# EAGLE design SmodIOXP (EAGLE 6.3)
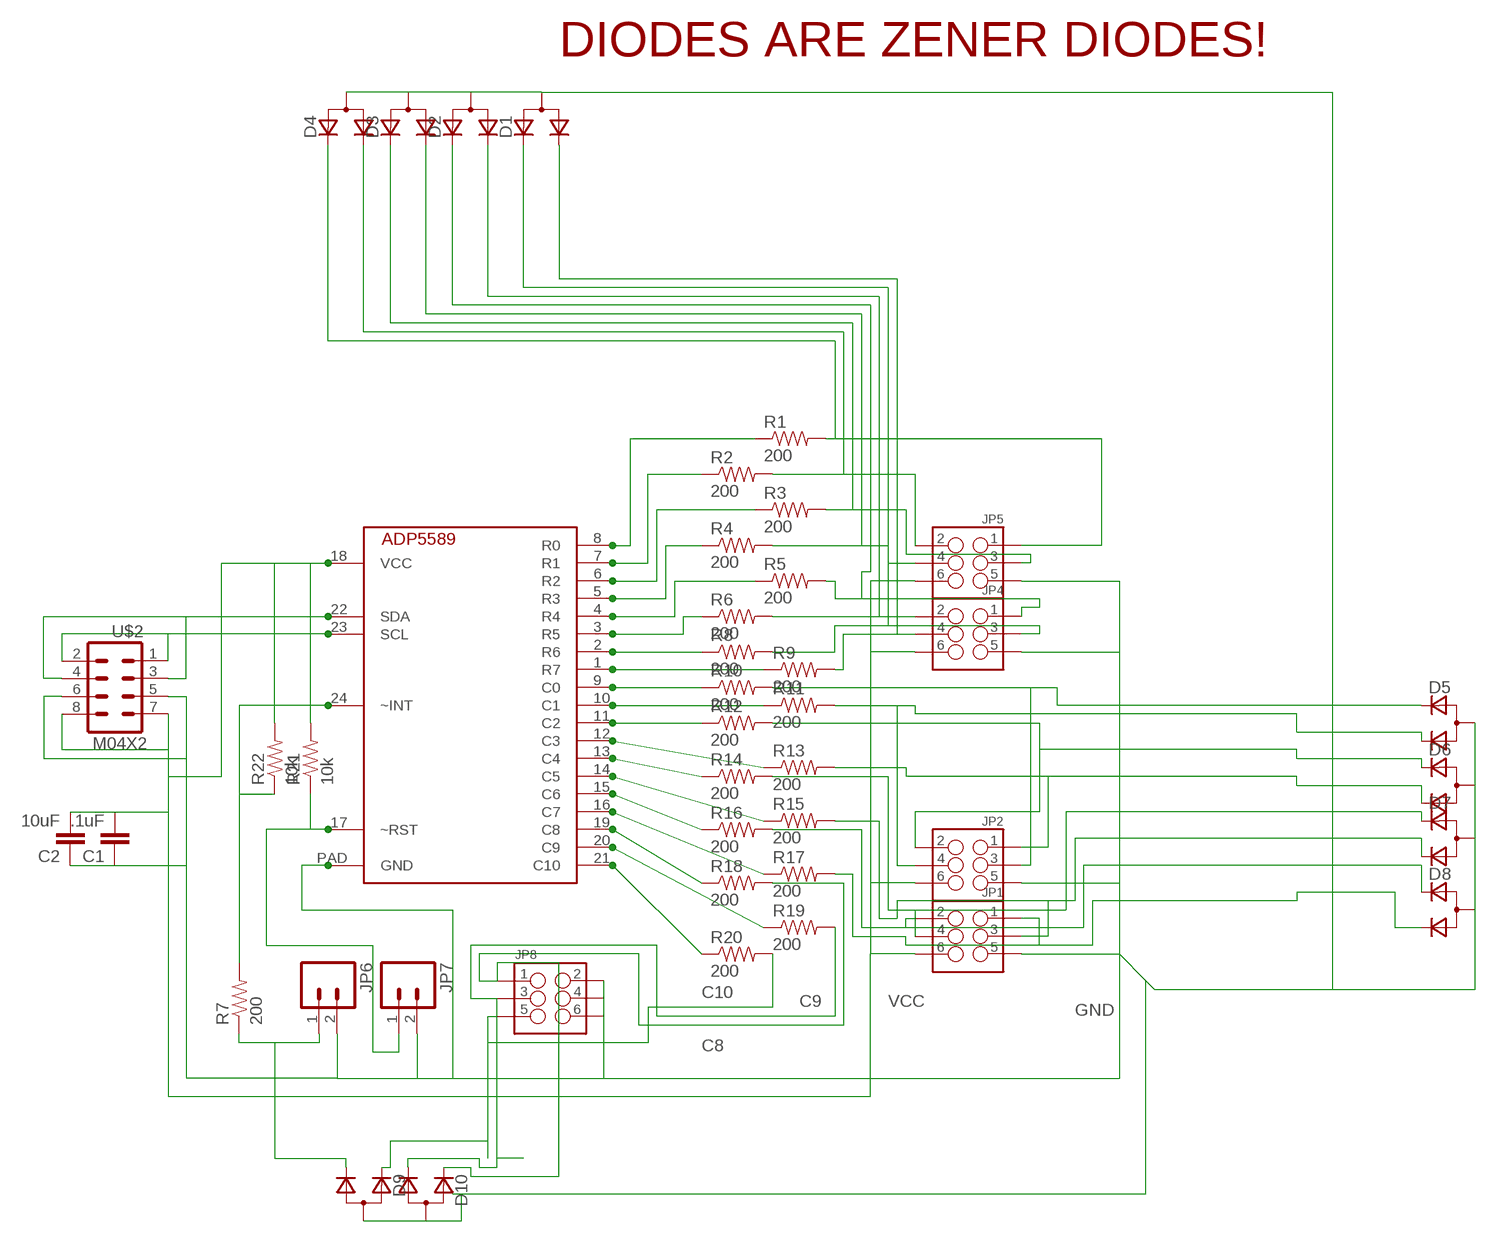
[diagram p0: schematic, sheet 1]

## Parts
C1  .1uF  CAP0603-CAP  [0603-CAP]
C2  10uF  CAP0603-CAP  [0603-CAP]
D1  D_2CSOT23  [SOT-23]
D2  D_2CSOT23  [SOT-23]
D3  D_2CSOT23  [SOT-23]
D4  D_2CSOT23  [SOT-23]
D5  D_2CSOT23  [SOT-23]
D6  D_2CSOT23  [SOT-23]
D7  D_2CSOT23  [SOT-23]
D8  D_2CSOT23  [SOT-23]
D9  D_2CSOT23  [SOT-23]
D10  D_2CSOT23  [SOT-23]
JP1  M03X2POGO_PINS  [2X3_POGO]
JP2  M03X2POGO_PINS  [2X3_POGO]
JP4  M03X2POGO_PINS  [2X3_POGO]
JP5  M03X2POGO_PINS  [2X3_POGO]
JP6  M02PTH  [1X02]
JP7  M02PTH  [1X02]
JP8  M03X2POGO_PINS  [2X3_POGO]
R1  200  RESISTOR0603-RES  [0603-RES]
R2  200  RESISTOR0603-RES  [0603-RES]
R3  200  RESISTOR0603-RES  [0603-RES]
R4  200  RESISTOR0603-RES  [0603-RES]
R5  200  RESISTOR0603-RES  [0603-RES]
R6  200  RESISTOR0603-RES  [0603-RES]
R7  200  RESISTOR0603-RES  [0603-RES]
R8  200  RESISTOR0603-RES  [0603-RES]
R9  200  RESISTOR0603-RES  [0603-RES]
R10  200  RESISTOR0603-RES  [0603-RES]
R11  200  RESISTOR0603-RES  [0603-RES]
R12  200  RESISTOR0603-RES  [0603-RES]
R13  200  RESISTOR0603-RES  [0603-RES]
R14  200  RESISTOR0603-RES  [0603-RES]
R15  200  RESISTOR0603-RES  [0603-RES]
R16  200  RESISTOR0603-RES  [0603-RES]
R17  200  RESISTOR0603-RES  [0603-RES]
R18  200  RESISTOR0603-RES  [0603-RES]
R19  200  RESISTOR0603-RES  [0603-RES]
R20  200  RESISTOR0603-RES  [0603-RES]
R21  10k  RESISTOR0603-RES  [0603-RES]
R22  10k  RESISTOR0603-RES  [0603-RES]
U$1  ADP5589LFCSP(QFN)  [24-LFCSP]
U$2  M04X2  [2X4]

## Nets
C0: D5.2(C1) JP2.P$3 R10.2
C1: D5.3(C2) JP2.P$4 R11.2
C2: D6.2(C1) JP2.P$2 R12.2
C3: D6.3(C2) JP2.P$1 R13.2
C4: D7.2(C1) JP1.P$4 R14.2
C5: D7.3(C2) JP1.P$3 R15.2
C6: D8.2(C1) JP1.P$2 R16.2
C7: D8.3(C2) JP1.P$1 R17.2
C8: D10.2(C1) JP8.P$1 R18.2
C9: D10.3(C2) JP8.P$3 R19.2
C10: D9.2(C1) JP8.P$5 R20.2
GND: C1.1 C2.1 D1.1(A) D2.1(A) D3.1(A) D4.1(A) D5.1(A) D6.1(A) D7.1(A) D8.1(A) D9.1(A) D10.1(A) JP1.P$5 JP2.P$5 JP4.P$5 JP5.P$5 JP6.2 JP7.2 JP8.P$2 JP8.P$4 JP8.P$6 U$1.PAD(GND) U$2.5 U$2.6
N$1: R1.1 U$1.8(R0)
N$3: R2.1 U$1.7(R1)
N$5: R3.1 U$1.6(R2)
N$6: D9.3(C2) JP6.1 R7.1
N$7: R4.1 U$1.5(R3)
N$9: R5.1 U$1.4(R4)
N$11: R6.1 U$1.3(R5)
N$13: R8.1 U$1.2(R6)
N$15: R9.1 U$1.1(R7)
N$17: R10.1 U$1.9(C0)
N$19: R11.1 U$1.10(C1)
N$21: R12.1 U$1.11(C2)
N$23: R13.1 U$1.12(C3)
N$25: R14.1 U$1.13(C4)
N$27: R15.1 U$1.14(C5)
N$29: R16.1 U$1.15(C6)
N$31: R17.1 U$1.16(C7)
N$33: R18.1 U$1.19(C8)
N$35: R19.1 U$1.20(C9)
N$37: R20.1 U$1.21(C10)
R0: D4.2(C1) JP5.P$1 R1.2
R1: D4.3(C2) JP5.P$2 R2.2
R2: D3.2(C1) JP5.P$3 R3.2
R3: D3.3(C2) JP5.P$4 R4.2
R4: D2.2(C1) JP4.P$1 R5.2
R5: D2.3(C2) JP4.P$2 R6.2
R6: D1.2(C1) JP4.P$3 R8.2
R7: D1.3(C2) JP4.P$4 R9.2
SCL: U$1.23(SCL) U$2.1 U$2.2
SDA: U$1.22(SDA) U$2.3 U$2.4
VCC: C1.2 C2.2 JP1.P$6 JP2.P$6 JP4.P$6 JP5.P$6 R21.2 R22.2 U$1.18(VCC) U$2.7 U$2.8
~INT: R7.2 R22.1 U$1.24(~INT)
~RST: JP7.1 R21.1 U$1.17(~RST)

## Notes on the sheet
- DIODES ARE ZENER DIODES!

## Library data of the parts
C1 C2 = SparkFun-Passives:CAP: Capacitor Standard 0603 ceramic capacitor, and 0.1" leaded capacitor.
D1-D10 = zetex:D_2C: Dual DIODE; OC_FARNELL: unknown; OC_NEWARK: unknown
JP1 JP2 JP4 JP5 JP8 = SparkFun-Connectors:M03X2: 2x3 .1" header. Shrouded, with keying- CONN-10681 SMT- CONN-11415 Pogo pins- HW-11044; PROD_ID: HW-11044
JP6 JP7 = SparkFun-Connectors:M02: Header 2 Standard 2-pin 0.1" header. Use with straight break away headers (SKU : PRT-00116), right angle break away headers (PRT-00553), swiss pins (PRT-00743), machine pins (PRT-00117), and female headers (PRT-00115). Molex polarized connector foot print use with SKU : PRT-08233 with associated crimp pins and housings.
R1-R22 = SparkFun-Passives:RESISTOR: Resistor Basic schematic elements and footprints for 0603, 1206, and PTH resistors.
U$1 = Strutz Electronic Industries:ADP5589
U$2 = SparkFun-Connectors:M04X2: .1" header, two rows of four.

## Board
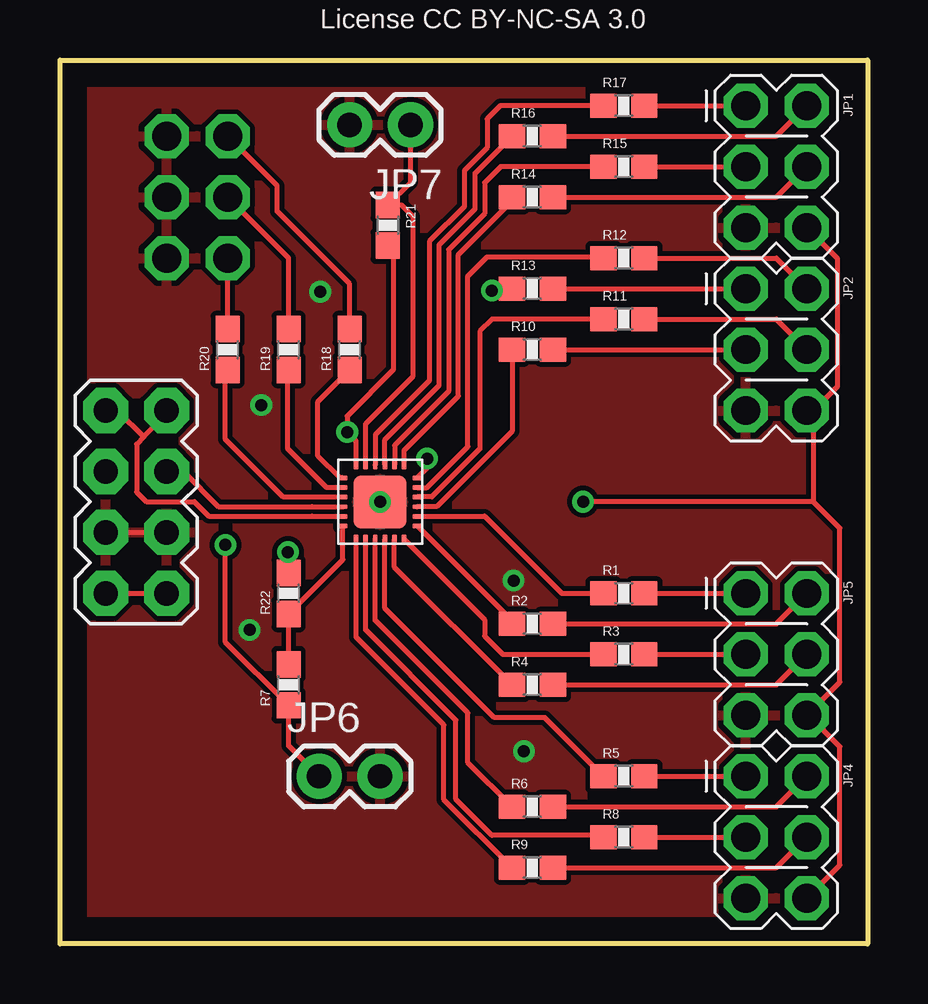
[diagram p1: board, top side]
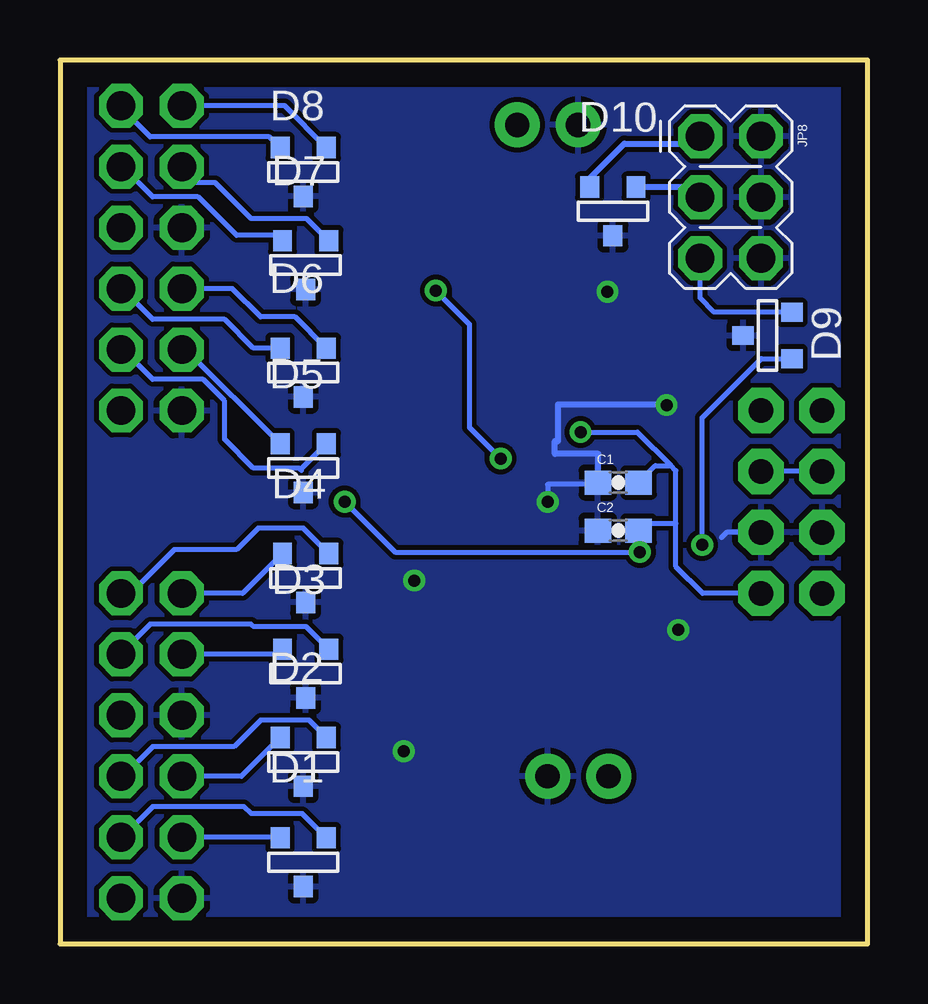
[diagram p2: board, bottom side, seen from below]

Size 33.66 x 36.83 mm. Coordinates in mm from the lower left corner, seen from the top.
Outline: 33.66,0 0,0 0,36.83 33.66,36.83 33.66,0
Copper layers (1*16): Top 0.035mm / dielectric 1.5mm / Bottom 0.035mm
Design rules "default": minimum track width 10mil, minimum drill 24mil, track to track 8mil, track to pad 8mil, pad to pad 8mil, via to via 8mil, smd to smd 8mil, copper to edge 40mil, drill to drill 8mil, minimum pad ring 10mil, minimum via ring 8mil, stop-mask expansion 4mil, vias tented up to drill 0mil, thermal gap 10mil

### Footprints (pad centres in the part's own frame; a part is rotated, then mirrored left to right if it is on the bottom)
0603-CAP = smd 1.1 x 1: 1 -0.85,0; 2 0.85,0
SOT-23 = smd 0.787 x 0.889: 1 0.025,-1.016; 2 -0.94,1.016; 3 0.991,1.016
2X3_POGO = drill 1.2 pad 1.829 octagon: P$1 0,0; P$2 0,2.54; P$3 2.54,0; P$4 2.54,2.54; P$5 5.08,0; P$6 5.08,2.54
1X02 = drill 1.016 pad 1.88: 1 0,0; 2 2.54,0
0603-RES = smd 1.1 x 1: 1 -0.85,0; 2 0.85,0
24-LFCSP = smd 0.4 x 0.2: 1 -1.55,1; 2 -1.55,0.6; 3 -1.55,0.2; 4 -1.55,-0.2; 5 -1.55,-0.6; 6 -1.55,-1; 13 1.55,-1; 14 1.55,-0.6; 15 1.55,-0.2; 16 1.55,0.2; 17 1.55,0.6; 18 1.55,1 | smd 0.2 x 0.4: 7 -1,-1.55; 8 -0.6,-1.55; 9 -0.2,-1.55; 10 0.2,-1.55; 11 0.6,-1.55; 12 1,-1.55; 19 1,1.55; 20 0.6,1.55; 21 0.2,1.55; 22 -0.2,1.55; 23 -0.6,1.55; 24 -1,1.55 | smd 2.2 x 2.2: PAD 0,0
2X4 = drill 1.016 pad 1.88 octagon: 1 -3.81,-1.27; 2 -3.81,1.27; 3 -1.27,-1.27; 4 -1.27,1.27; 5 1.27,-1.27; 6 1.27,1.27; 7 3.81,-1.27; 8 3.81,1.27

### Placement (x,y rotation side)
C1  10.4,19.22 0 bottom
C2  10.4,17.22 0 bottom
D1  23.54,3.41 0 bottom
D2  23.54,7.58 0 bottom
D3  23.45,11.27 0 bottom
D4  23.45,15.25 0 bottom
D5  23.54,19.82 0 bottom
D6  23.54,23.8 0 bottom
D7  23.45,28.29 0 bottom
D8  23.54,32.17 0 bottom
D9  4.17,25.38 270 bottom
D10  10.65,30.53 0 bottom
JP1  28.57,34.93 270 top
JP2  28.57,27.3 270 top
JP4  28.57,6.99 270 top
JP5  28.57,14.61 270 top
JP6  10.79,6.99 0 top
JP7  14.61,34.12 180 top
JP8  6.99,33.66 270 bottom
R1  23.49,14.61 0 top
R2  19.68,13.34 0 top
R3  23.49,12.07 0 top
R4  19.68,10.8 0 top
R5  23.49,6.99 0 top
R6  19.68,5.72 0 top
R7  9.53,10.8 90 top
R8  23.49,4.45 0 top
R9  19.68,3.17 0 top
R10  19.68,24.77 0 top
R11  23.49,26.04 0 top
R12  23.49,28.57 0 top
R13  19.68,27.3 0 top
R14  19.68,31.11 0 top
R15  23.49,32.39 0 top
R16  19.68,33.66 0 top
R17  23.49,34.93 0 top
R18  12.07,24.77 90 top
R19  9.53,24.77 90 top
R20  6.99,24.77 90 top
R21  13.66,29.94 270 top
R22  9.53,14.61 90 top
U$1  13.34,18.41 90 top
U$2  3.17,18.41 270 top

### Tracks (layer width: path | path; a pad name or v marks a point on that pad's centre or on a via)
C0
  Top 0.2: R10.2 JP2.P$3
  Bottom 0.2: D5.2 28.41,24.77 JP2.P$3
C1
  Top 0.2: R11.2 29.84,26.04 JP2.P$4
  Bottom 0.2: D5.3 23.59,19.8 23.59,19.72 23.7,19.82 25.59,19.82 26.79,21.02 26.79,22.62 27.7,23.52 29.79,23.52 31.03,24.77 JP2.P$4
C2
  Top 0.2: R12.2 29.84,28.57 JP2.P$2
  Bottom 0.2: D6.2 25.59,24.82 26.79,26.02 29.79,26.02 31.07,27.3 JP2.P$2
C3
  Top 0.2: R13.2 JP2.P$1
  Bottom 0.2: D6.3 23.86,26.12 25.29,26.12 26.47,27.3 JP2.P$1
C4
  Top 0.2: R14.2 29.84,31.11 JP1.P$4
  Bottom 0.2: D7.2 24.61,29.53 26.29,29.53 27.89,31.12 29.79,31.12 31.05,32.39 JP1.P$4
C5
  Top 0.2: R15.2 JP1.P$3
  Bottom 0.2: D7.3 23.38,30.22 25.7,30.22 27.2,31.72 28.09,31.72 28.57,32.21 JP1.P$3
C6
  Top 0.2: R16.2 29.84,33.66 JP1.P$2
  Bottom 0.2: D8.2 24.93,33.62 29.89,33.62 31.12,34.85 JP1.P$2
C7
  Top 0.2: R17.2 JP1.P$1
  Bottom 0.2: D8.3 24.3,34.93 JP1.P$1
C8
  Top 0.2: R18.2 12.07,27.5 9.04,30.53 9.04,31.6 JP8.P$1
  Bottom 0.254: D10.2 11.59,31.9 10.13,33.35 7.29,33.35 JP8.P$1
C9
  Top 0.2: R19.2 9.53,28.57 JP8.P$3
  Bottom 0.254: D10.3 7.41,31.54 JP8.P$3
C10
  Top 0.2: R20.2 JP8.P$5
  Bottom 0.2: D9.2 3.17,26.32 6.4,26.32 6.99,26.91 JP8.P$5
GND  (via drill 0.5 pad 0.25)
  Top 0.2: U$2.5 U$2.6
  Bottom 0.2: U$2.6 5.88,17.14 6.09,16.93 | C1.1 11.32,19.15 13.34,19.15 U$1.PAD
  Bottom 0.254: C1.1 11.23,19.22 11.23,20.42 13.03,20.42 13.03,20.95 12.9,20.95 12.9,22.48 8.33,22.48 8.33,22.4 | 8.33,22.38 8.33,22.4 | 8.33,22.4 8.53,22.4 8.53,22.55
  other vias: 13.34,18.41 7.9,13.08 18.9,15.14 19.33,8.03 10.85,27.18 8.38,22.45
  pour Bottom: 0,0 33.66,0 33.66,36.83 0,36.83
  pour Top: -1.17,-2.44 35.36,-2.44 35.36,37.92 -1.17,37.92
N$1
  Top 0.2: U$1.8 17.68,17.81 17.7,17.82 20.91,14.61 R1.1
N$3
  Top 0.2: U$1.7 18.83,13.46 R2.1
N$5
  Top 0.2: U$1.6 17.7,13.5 17.7,12.82 18.45,12.07 R3.1
N$6  (via drill 0.5 pad 0.25)
  Top 0.2: JP6.1 9.53,8.25 R7.1 6.9,12.57 v6.9,16.62
  Bottom 0.2: v6.9,16.62 6.9,21.93 4.44,24.38 D9.3
N$7
  Top 0.2: R4.1 13.94,15.7 U$1.5
N$9
  Top 0.2: R5.1 20.2,9.43 18.09,9.43 13.54,13.98 U$1.4
N$11
  Top 0.2: R6.1 16.99,7.56 16.99,9.62 13.13,13.48 U$1.3
N$13
  Top 0.2: R8.1 22.56,4.53 17.99,4.53 16.49,6.02 16.49,9.32 12.74,13.09 U$1.2
N$15
  Top 0.2: R9.1 15.99,6.01 15.99,9.12 12.34,12.79 U$1.1
N$17
  Top 0.2: R10.1 18.83,21.36 15.7,18.22 U$1.9
N$19
  Top 0.2: R11.1 18,26.04 17.49,25.52 17.49,20.62 15.49,18.62 U$1.10
N$21
  Top 0.2: U$1.11 15.29,19.02 16.99,20.72 16.99,27.82 17.79,28.62 22.59,28.62 R12.1
N$23  (via drill 0.5 pad 0.25)
  Top 0.2: R13.1 18.07,27.3 v17.99,27.22 | v15.29,20.22 15.29,19.82 U$1.12
  Bottom 0.2: v17.99,27.22 16.59,25.82 16.59,21.52 v15.29,20.22
N$25
  Top 0.2: U$1.13 14.33,20.56 16.59,22.82 16.59,28.72 18.83,30.96 R14.1
N$27
  Top 0.2: R15.1 18.36,32.39 17.7,31.72 17.7,30.43 16.2,28.93 16.2,23.02 13.95,20.77 U$1.14
N$29
  Top 0.2: U$1.15 13.54,21.02 15.79,23.27 15.79,29.12 17.29,30.62 17.29,32.12 R16.1
N$31
  Top 0.2: R17.1 18.34,34.93 17.79,34.38 17.79,33.18 16.84,32.23 16.84,30.72 15.4,29.28 15.4,23.47 13.15,21.22 U$1.16
N$33
  Top 0.2: U$1.19 11.66,19.41 10.75,20.32 10.75,22.59 R18.1
N$35
  Top 0.2: U$1.20 11.11,19.02 9.5,20.62 9.5,23.88 R19.1
N$37
  Top 0.2: U$1.21 9.31,18.61 6.9,21.02 6.9,23.82 R20.1
R0
  Top 0.2: R1.2 JP5.P$1
  Bottom 0.2: D4.2 26.04,14.61 JP5.P$1
R1
  Top 0.2: R2.2 29.84,13.34 JP5.P$2
  Bottom 0.2: D4.3 23.52,17.32 25.39,17.32 26.29,16.43 28.89,16.43 30.71,14.61 JP5.P$2
R2
  Top 0.2: R3.2 JP5.P$3
  Bottom 0.2: D3.2 24.6,12.07 JP5.P$3
R3
  Top 0.2: R4.2 29.84,10.8 JP5.P$4
  Bottom 0.2: D3.3 23.4,13.22 25.59,13.22 25.7,13.32 29.89,13.32 31.12,12.11 JP5.P$4
R4
  Top 0.2: R5.2 JP4.P$1
  Bottom 0.2: D2.2 26.1,6.99 JP4.P$1
R5
  Top 0.2: R6.2 29.84,5.72 JP4.P$2
  Bottom 0.2: D2.3 23.28,9.32 25.29,9.32 26.39,8.23 29.79,8.23 31.03,6.99 JP4.P$2
R6
  Top 0.2: R8.2 JP4.P$3
  Bottom 0.2: D1.2 24.51,4.45 JP4.P$3
R7
  Top 0.2: R9.2 29.84,3.17 JP4.P$4
  Bottom 0.2: D1.3 23.56,5.42 25.7,5.42 25.99,5.73 29.79,5.73 31.07,4.45 JP4.P$4
SCL
  Top 0.2: U$2.2 4.44,22.07 3.5,21.12 | 3.5,21.12 3.19,20.82 3.19,18.82 3.59,18.43 5.59,18.43 6.19,17.82 10.51,17.82 U$1.23 | U$2.1 2.39,22.22 3.5,21.12
SDA
  Top 0.2: U$2.4 5.13,19.68 6.59,18.22 10.51,18.22 U$1.22
  Bottom 0.2: U$2.3 U$2.4
VCC  (via drill 0.5 pad 0.25)
  Top 0.2: U$2.7 U$2.8 | U$1.18 12.34,20.95 v11.96,21.32 11.96,22 13.9,23.93 13.9,28.86 R21.2 | JP1.P$6 32.39,28.56 32.39,23.22 31.39,22.22 JP2.P$6 31.39,21.95 31.39,18.43 | JP4.P$6 32.49,3.29 32.49,8.23 31.2,9.52 JP5.P$6 32.49,10.91 32.49,17.32 31.39,18.43 | 31.39,18.43 v21.79,18.43 | v9.5,16.32 9.53,16.29 R22.2
  Bottom 0.2: U$2.8 6.87,14.61 8,15.72 8,17.52 | 8,17.52 8,19.72 8.2,19.93 | 8.2,19.93 9.6,21.32 v11.96,21.32 | C1.2 8.85,19.93 8.2,19.93 | 8,17.52 9.25,17.52 C2.2 9.5,17.18 v9.5,16.32 19.7,16.32 v21.79,18.43
~INT
  Top 0.2: R7.2 R22.1 11.79,16.02 U$1.24
~RST
  Top 0.2: JP7.1 14.61,31.75 R21.1 14.22,30.79 14.7,30.32 14.7,23.62 12.74,21.66 U$1.17

### Text on the board
_tsilk: Made by Shannon Strutz / For the University of Wisconsin - Stout / 2013 / / License CC BY-NC-SA 3.0